# Altium schematic sheet LNA_DIV.SchDoc
size A4 portrait; CompanyName: FairWaves LLC; DrawnBy: Andrey Sviyazov; DocumentNumber: 3; Revision: 1; SheetNumber: 3; SheetTotal: 5
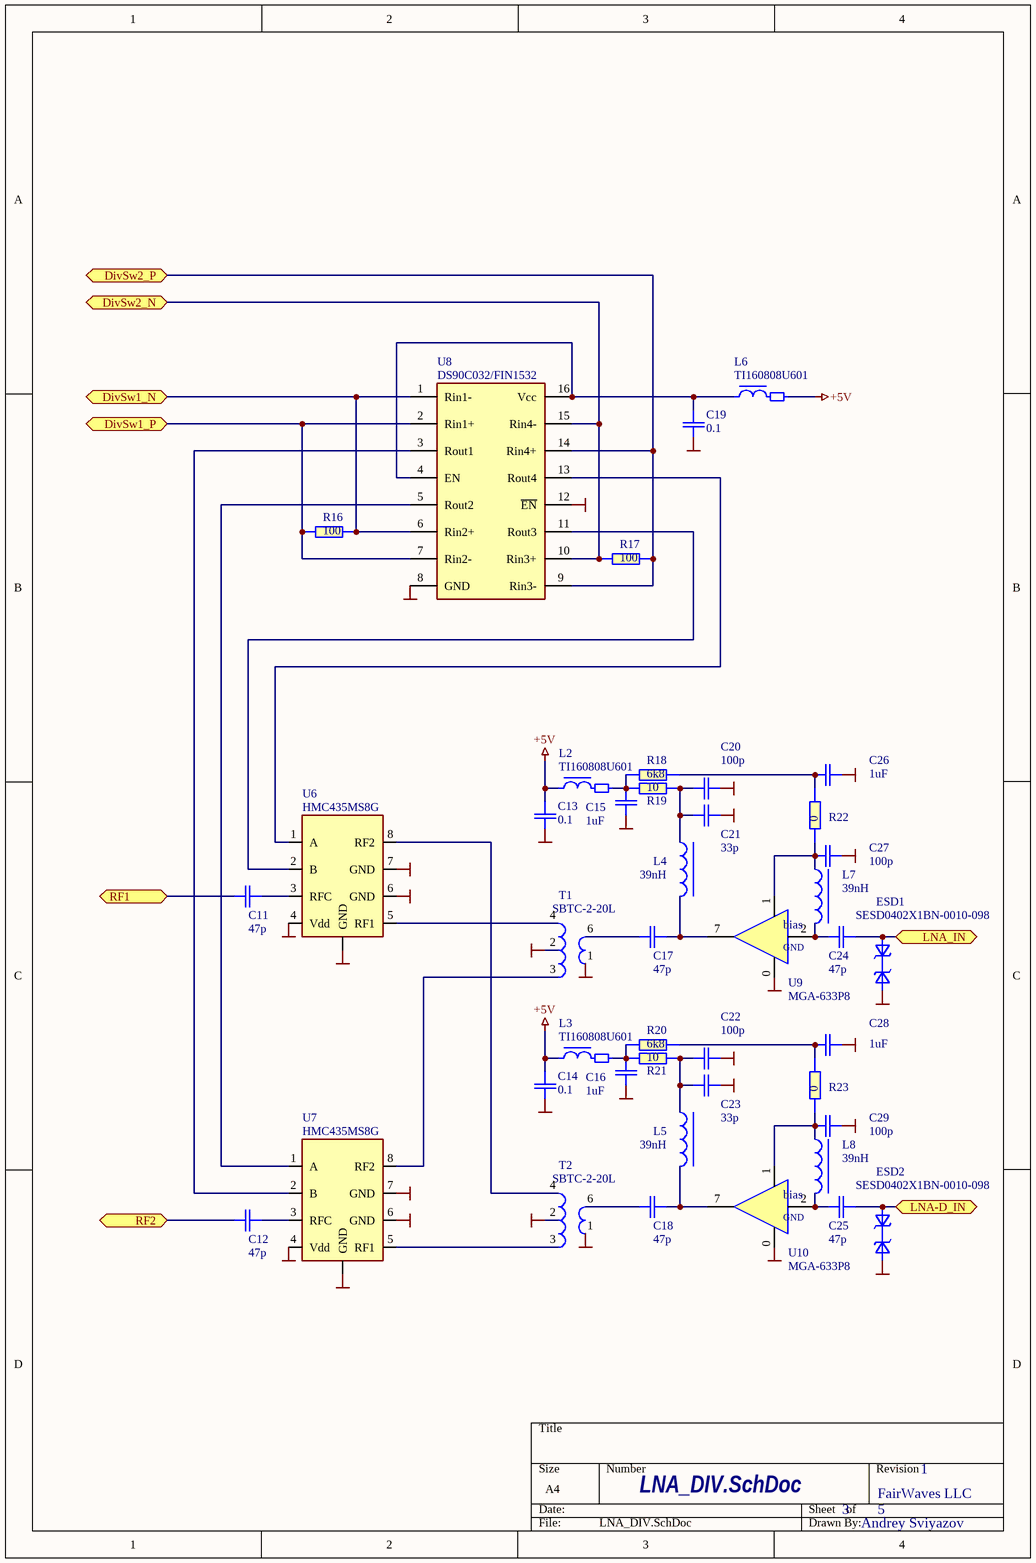
[diagram p0: LNA_DIV.SchDoc]

## Parts
C11  47p  [C0603-PHILLIPS]
C12  47p  [C0603-PHILLIPS]
C13  0.1  [C0603-Phillips]
C14  0.1  [C0603-Phillips]
C15  1uF  [C0603-Phillips]
C16  1uF  [C0603-Phillips]
C17  47p  [C0603-PHILLIPS]
C18  47p  [C0603-PHILLIPS]
C19  0.1  [C0603-Phillips]
C20  100p  [C0603-PHILLIPS]
C21  33p  [C0603-PHILLIPS]
C22  100p  [C0603-PHILLIPS]
C23  33p  [C0603-PHILLIPS]
C24  47p  [C0603-PHILLIPS]
C25  47p  [C0603-PHILLIPS]
C26  1uF  [C0603-Phillips]
C27  100p  [C0603-PHILLIPS]
C28  1uF  [C0603-Phillips]
C29  100p  [C0603-PHILLIPS]
ESD1  SESD0402X1BN-0010-098  [R0402-Phillips]
ESD2  SESD0402X1BN-0010-098  [R0402-Phillips]
L2  TI160808U601  [Ti160808-Phillips]
L3  TI160808U601  [Ti160808-Phillips]
L4  39nH  [TF160808-Phillips]
L5  39nH  [TF160808-Phillips]
L6  TI160808U601  [Ti160808-Phillips]
L7  39nH  [TF160808-Phillips]
L8  39nH  [TF160808-Phillips]
R16  100  [R0603-PHILLIPS]
R17  100  [R0603-PHILLIPS]
R18  6k8  [R0603-PHILLIPS]
R19  10  [R0603-PHILLIPS]
R20  6k8  [R0603-PHILLIPS]
R21  10  [R0603-PHILLIPS]
R22  0  [R0603-PHILLIPS]
R23  0  [R0603-PHILLIPS]
T1  SBTC-2-20L  [AT1030]
T2  SBTC-2-20L  [AT1030]
U6  HMC435MS8G  [MS8G]
U7  HMC435MS8G  [MS8G]
U8  DS90C032/FIN1532  [SOIC16]
U9  MGA-633P8  [SLP2x2]
U10  MGA-633P8  [SLP2x2]

## Ports
DivSw1_N, DivSw1_P, DivSw2_N, DivSw2_P, LNA-D_IN, LNA_IN, RF1, RF2

## Nets
+5V: C13.2 C14.2 L2.1 L3.1 L6.2
GND: C13.1 C14.1 C15.1 C16.1 C19.1 C20.2 C21.2 C22.2 C23.2 C26.2 C27.2 C28.2 C29.2 ESD1.1(A1) ESD2.1(A1) T1.1 T1.2 T2.1 T2.2 U6.0(GND) U6.4(Vdd) U6.6(GND) U6.7(GND) U7.0(GND) U7.4(Vdd) U7.6(GND) U7.7(GND) U8.8(GND) U8.12(~{EN}) U9.0(GND) U10.0(GND)
DivSw1_N: R16.2 U8.1(Rin1-) U8.6(Rin2+) ; port DivSw1_N
DivSw1_P: R16.1 U8.2(Rin1+) U8.7(Rin2-) ; port DivSw1_P
DivSw2_N: R17.1 U8.10(Rin3+) U8.15(Rin4-) ; port DivSw2_N
DivSw2_P: R17.2 U8.9(Rin3-) U8.14(Rin4+) ; port DivSw2_P
LNA-D_IN: C25.2 ESD2.2(A2) ; port LNA-D_IN
LNA_IN: C24.2 ESD1.2(A2) ; port LNA_IN
RF1: C11.1 ; port RF1
RF2: C12.1 ; port RF2
NetC11_2: C11.2 U6.3(RFC)
NetC12_2: C12.2 U7.3(RFC)
NetC15_2: C15.2 L2.2 R18.1 R19.1
NetC16_2: C16.2 L3.2 R20.1 R21.1
NetC17_1: C17.1 T1.6
NetC17_2: C17.2 L4.2 U9.7(RFout/VDD)
NetC18_1: C18.1 T2.6
NetC18_2: C18.2 L5.2 U10.7(RFout/VDD)
NetC19_2: C19.2 L6.1 U8.4(EN) U8.16(Vcc)
NetC20_1: C20.1 C21.1 L4.1 R19.2
NetC22_1: C22.1 C23.1 L5.1 R21.2
NetC24_1: C24.1 L7.2 U9.2(A)
NetC25_1: C25.1 L8.2 U10.2(A)
NetC26_1: C26.1 R18.2 R22.2
NetC27_1: C27.1 L7.1 R22.1 U9.1(BIAS)
NetC28_1: C28.1 R20.2 R23.2
NetC29_1: C29.1 L8.1 R23.1 U10.1(BIAS)
NetT1_3: T1.3 U7.8(RF2)
NetT1_4: T1.4 U6.5(RF1)
NetT2_3: T2.3 U7.5(RF1)
NetT2_4: T2.4 U6.8(RF2)
NetU6_1: U6.1(A) U8.13(Rout4)
NetU6_2: U6.2(B) U8.11(Rout3)
NetU7_1: U7.1(A) U8.5(Rout2)
NetU7_2: U7.2(B) U8.3(Rout1)

## Notes on the sheet
- (in symbol MGA-633P8) bias

## Library data of the parts
C11 C12 C17 C18 C20-C25 C27 C29 = C0603: Capacitor; Manufacturer: MURATA; Tolerance: 20%; Name: SMD0603; U/P/TKE: NP0
  C11 C12 C17 C18 C24 C25: Value: 47p
  C20 C22 C27 C29: Value: 100p
  C21 C23: Value: 33p
C13-C16 C19 C26 C28 = C0603: Capacitor; Manufacturer: MURATA; Tolerance: 20%; Name: SMD0603; U/P/TKE: Y5V
  C13 C14 C19: Value: 0.1
  C15 C16 C26 C28: Value: 1uF
ESD1 ESD2 = SESD0402X: ESD diod bi-directional; Manufacturer: Tyco Electronics Corp; U/P/TKE: 9.8V; Name: SESD0402X1BN-0010-098
L2 L3 L6 = TI160808: Choke; Manufacturer: MURATA; Name: TI160808U601; Value: *
L4 L5 L7 L8 = TF160808: Coil; Manufacturer: SMD; Name: TF160808; Value: 39nH
R16-R23 = R0603: Resistor; Manufacturer: YAGEO; Tolerance: 5%; Name: SMD0603; U/P/TKE: 0.1W
  R16 R17: Value: 100
  R18 R20: Value: 6k8
  R19 R21: Value: 10
  R22 R23: Value: 0
T1 T2 = SBTC-2-10L: Transformer; Manufacturer: Mini-Cirquits; Name: SBTC-2-20L
U6 U7 = HMC435MS8G: IC; Manufacturer: Hittite; Swap: No; Misc: High IP3 Mixer with  LO Amp; Name: HMC435MS8G
U8 = DS90C032: IC; Manufacturer: National/Fairchild; Swap: No; Misc: Quad LVDS Receiver; Name: DS90C032/FIN1532
U9 U10 = MGA-633P8: IC; Manufacturer: Avago; Swap: No; Misc: Ultra Low Noise, High Linearity Active Bias Low Noise Amplifi er; PDF: d:\Proj\Components\Avago\MGA-633P8.pdf; Name: MGA-633P8